# EAGLE design Incubadora-v1 (EAGLE 7.3.0)
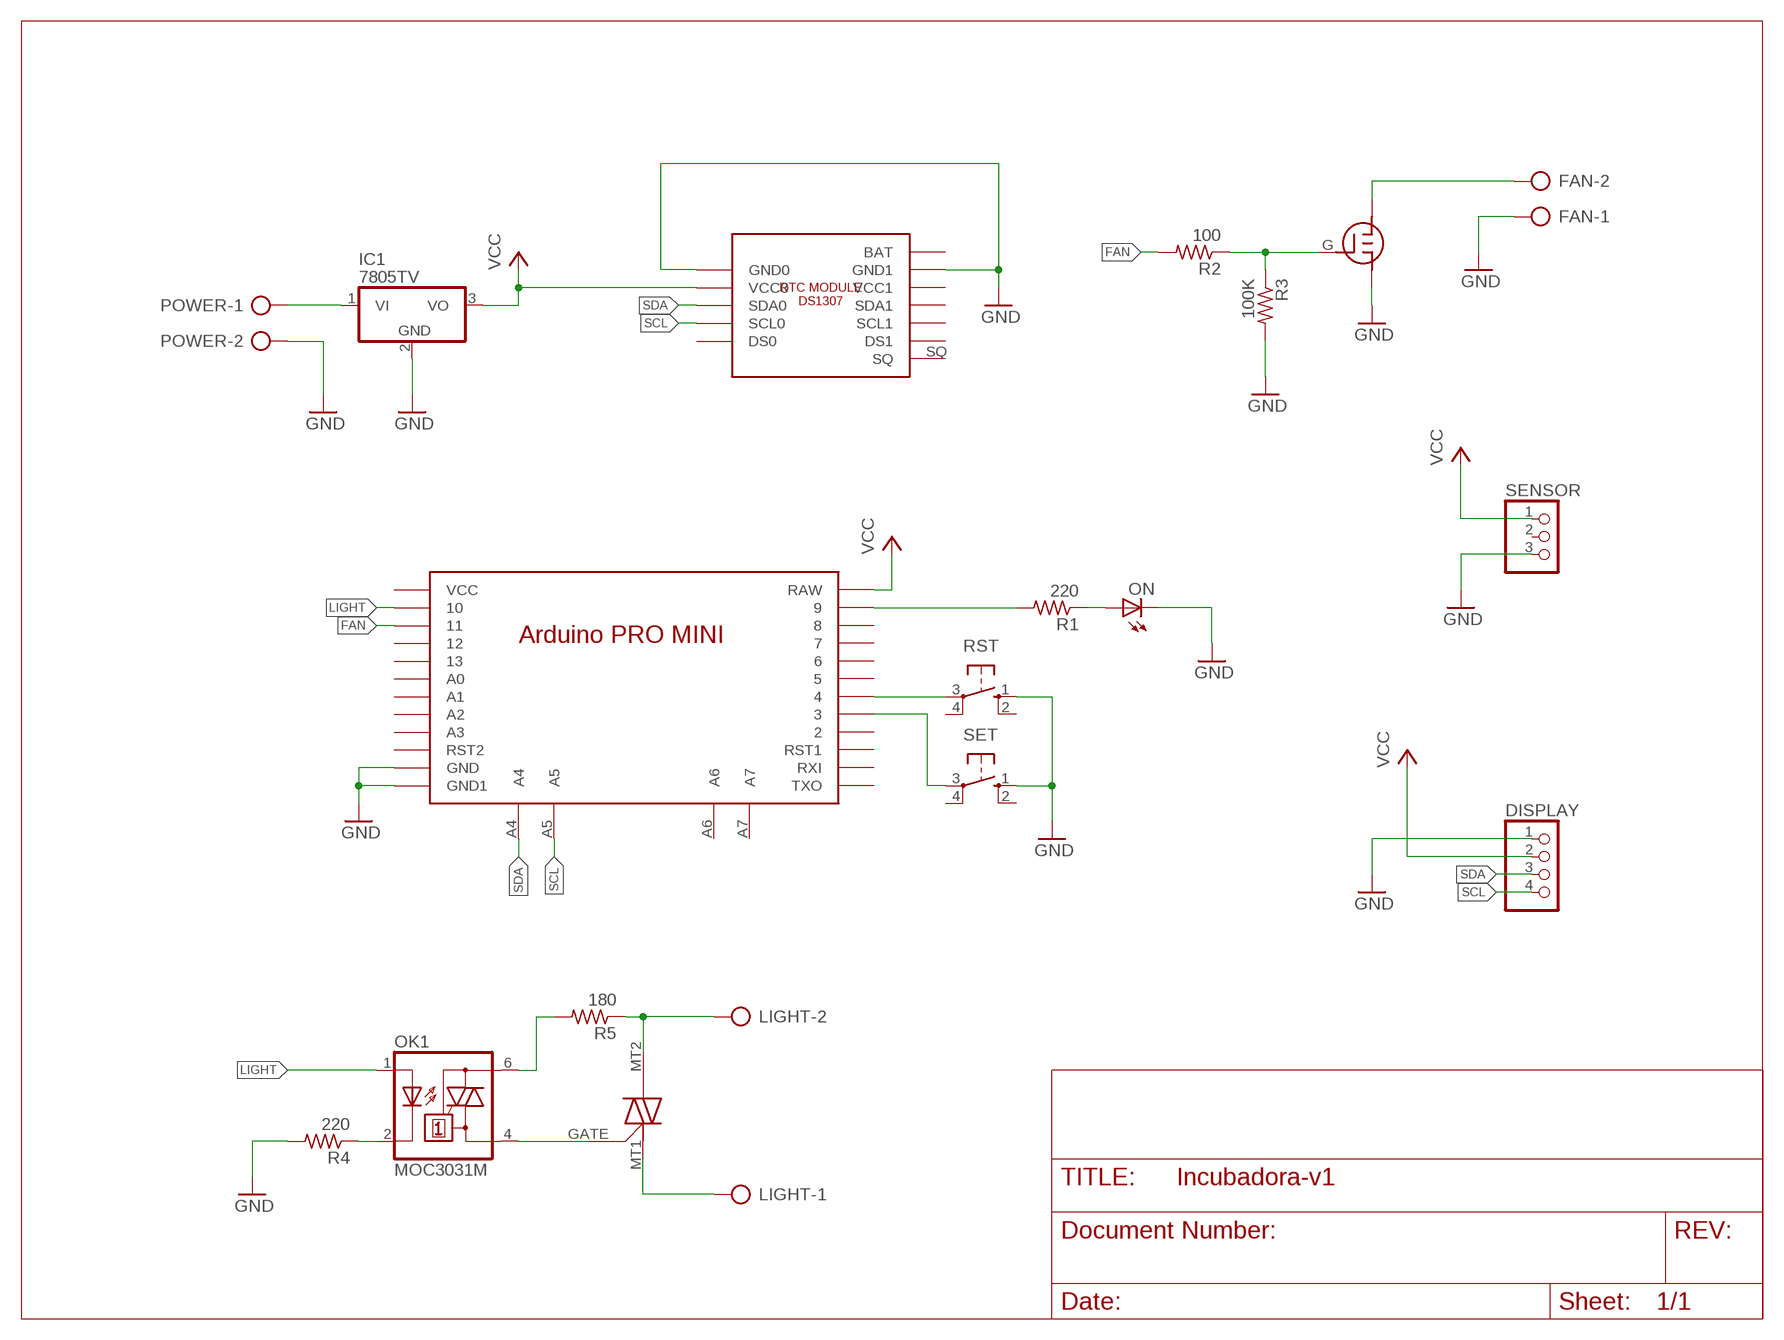
[diagram p0: schematic, sheet 1]

## Parts
DISPLAY  PINHD-1X4  [1X04]
FAN  AK300/2  [AK300/2]
IC1  7805TV  [TO220V]
LIGHT  AK300/2  [AK300/2]
MAC12  MAC12  [MAC12]
OK1  MOC3031M  [DIL06]
ON  LED3MM  [LED3MM]
POWER  AK300/2  [AK300/2]
R1  220  R-US_0204/7  [0204/7]
R2  100  R-US_0204/7  [0204/7]
R3  100K  R-US_0204/7  [0204/7]
R4  220  R-US_0204/7  [0204/7]
R5  180  R-US_0204/7  [0204/7]
RST  10-XX  [B3F-10XX]
SENSOR  PINHD-1X3/90  [1X03/90]
SET  10-XX  [B3F-10XX]
U$1  CLOCK  [CLOCK]
U$2  PROMINI  [PROMINI]
U$3  J111  [J111]

## Nets
FAN: R2.2 U$2.11
GND: DISPLAY.1 FAN.1 IC1.2(GND) ON.K(C) POWER.2 R3.2 R4.2 RST.1(S) SENSOR.3 SET.1(S) U$1.GND0 U$1.GND1 U$2.GND1(GND) U$2.GND2(GND1) U$3.S
LIGHT: OK1.1(A) U$2.10
N$1: ON.A R1.1
N$2: IC1.1(VI) POWER.1
N$3: RST.3(P) U$2.4
N$4: SET.3(P) U$2.3
N$5: R1.2 U$2.9
N$6: FAN.2 U$3.D
N$7: R2.1 R3.1 U$3.G
N$8: LIGHT.2 MAC12.MT2 R5.1
N$9: LIGHT.1 MAC12.MT1
N$10: OK1.2(C) R4.1
N$11: MAC12.GATE OK1.4(A1)
N$12: OK1.6(A2) R5.2
SCL: DISPLAY.4 U$1.SCL0 U$2.A5
SDA: DISPLAY.3 U$1.SDA0 U$2.A4
VCC: DISPLAY.2 IC1.3(VO) SENSOR.1 U$1.VCC0 U$2.RAW
Unconnected: RST.2(S1) RST.4(P1) SENSOR.2 SET.2(S1) SET.4(P1) U$1.BAT U$1.DS0 U$1.DS1 U$1.SCL1 U$1.SDA1 U$1.SQ U$1.VCC1 U$2.2 U$2.5 U$2.6 U$2.7 U$2.8 U$2.12 U$2.13 U$2.A0 U$2.A1 U$2.A2 U$2.A3 U$2.A6 U$2.A7 U$2.RST1 U$2.RST2 U$2.RXI U$2.TXO U$2.VCC

## Library data of the parts
DISPLAY = pinhead:PINHD-1X4: PIN HEADER
FAN LIGHT POWER = con-ptr500:AK300/2: CONNECTOR; OC_FARNELL: unknown; OC_NEWARK: unknown
IC1 = linear:78*: Positive VOLTAGE REGULATOR Source: http://cache.national.com/ds/LM/LM78L05.pdf http://www.fairchildsemi.com/ds/LM/LM7805.pdf
MAC12 = CustomLib:MAC12
OK1 = optocoupler:MOC30*: 6-Pin DIP Zero-Cross Optoisolators Triac Driver Output (250/400 Volt Peak) Source: Data sheet <http://www.fairchildsemi.com/ds/MO/MOC3031M.pdf> The old path of data sheet not more available 2013-05-06.; MF: FAIRCHILD SEMICONDUCTOR; MPN: MOC3031M; OC_FARNELL: 9875964; OC_NEWARK: 78K6089
ON = led:LED: LED OSRAM: - CHIPLED LG R971, LG N971, LY N971, LG Q971, LY Q971, LO R971, LY R971 LH N974, LH R974 LS Q976, LO Q976, LY Q976 LO Q996 - Hyper CHIPLED LW Q18S LB Q993, LB Q99A, LB R99A - SideLED LS A670, LO A670, LY A670, LG A670, LP A670 LB A673, LV A673, LT A673, LW A673 LH A674 LY A675 LS A676, LA A676, LO A676, LY A676, LW A676 LS A679, LY A679, LG A679 - Hyper Micro SIDELED® LS Y876, LA Y876, LO Y876, LY Y876 LT Y87S - SmartLED LW L88C, LW L88S LB L89C, LB L89S, LG L890 LS L89K, LO L89K, LY L89K LS L896, LA L896, LO L896, LY L896 - TOPLED LS T670, LO T670, LY T670, LG T670, LP T670 LSG T670, LSP T670, LSY T670, LOP T670, LYG T670 LG T671, LOG T671, LSG T671 LB T673, LV T673, LT T673, LW T673 LH T674 LS T676, LA T676, LO T676, LY T676, LB T676, LH T676, LSB T676, LW T676 LB T67C, LV T67C, LT T67C, LS T67K, LO T67K, LY T67K, LW E67C LS E67B, LA E67B, LO E67B, LY E67B, LB E67C, LV E67C, LT E67C LW T67C LS T679, LY T679, LG T679 LS T770, LO T770, LY T770, LG T770, LP T770 LB T773, LV T773, LT T773, LW T773 LH T774 LS E675, LA E675, LY E675, LS T675 LS T776, LA T776, LO T776, LY T776, LB T776 LHGB T686 LT T68C, LB T68C - Hyper Mini TOPLED® LB M676 - Mini TOPLED Santana® LG M470 LS M47K, LO M47K, LY M47K Source: http://www.osram.convergy.de LUXEON: - LUMILED® LXK2-PW12-R00, LXK2-PW12-S00, LXK2-PW14-U00, LXK2-PW14-V00 LXK2-PM12-R00, LXK2-PM12-S00, LXK2-PM14-U00 LXK2-PE12-Q00, LXK2-PE12-R00, LXK2-PE12-S00, LXK2-PE14-T00, LXK2-PE14-U00 LXK2-PB12-K00, LXK2-PB12-L00, LXK2-PB12-M00, LXK2-PB14-N00, LXK2-PB14-P00, LXK2-PB14-Q00 LXK2-PR12-L00, LXK2-PR12-M00, LXK2-PR14-Q00, LXK2-PR14-R00 LXK2-PD12-Q00, LXK2-PD12-R00, LXK2-PD12-S00 LXK2-PH12-R00, LXK2-PH12-S00 LXK2-PL12-P00, LXK2-PL12-Q00, LXK2-PL12-R00 Source: www.luxeon.com KINGBRIGHT: KA-3528ASYC Source: www.kingbright.com
R1-R5 = resistor:R-US_: RESISTOR, American symbol
RST SET = switch-omron:10-XX: OMRON SWITCH; MPN: B3F-1000; OC_FARNELL: 176432; OC_NEWARK: 36M3542
SENSOR = pinhead:PINHD-1X3: PIN HEADER
U$1 = CustomLib:CLOCK
U$2 = CustomLib:PROMINI
U$3 = CustomLib:J111: Mosfet J111 This device is designed for low level analog switching, sample and hold circuits and chopper stabilized amplifiers. Sourced from Process 51. Source & Drain are interchangeable

## Board
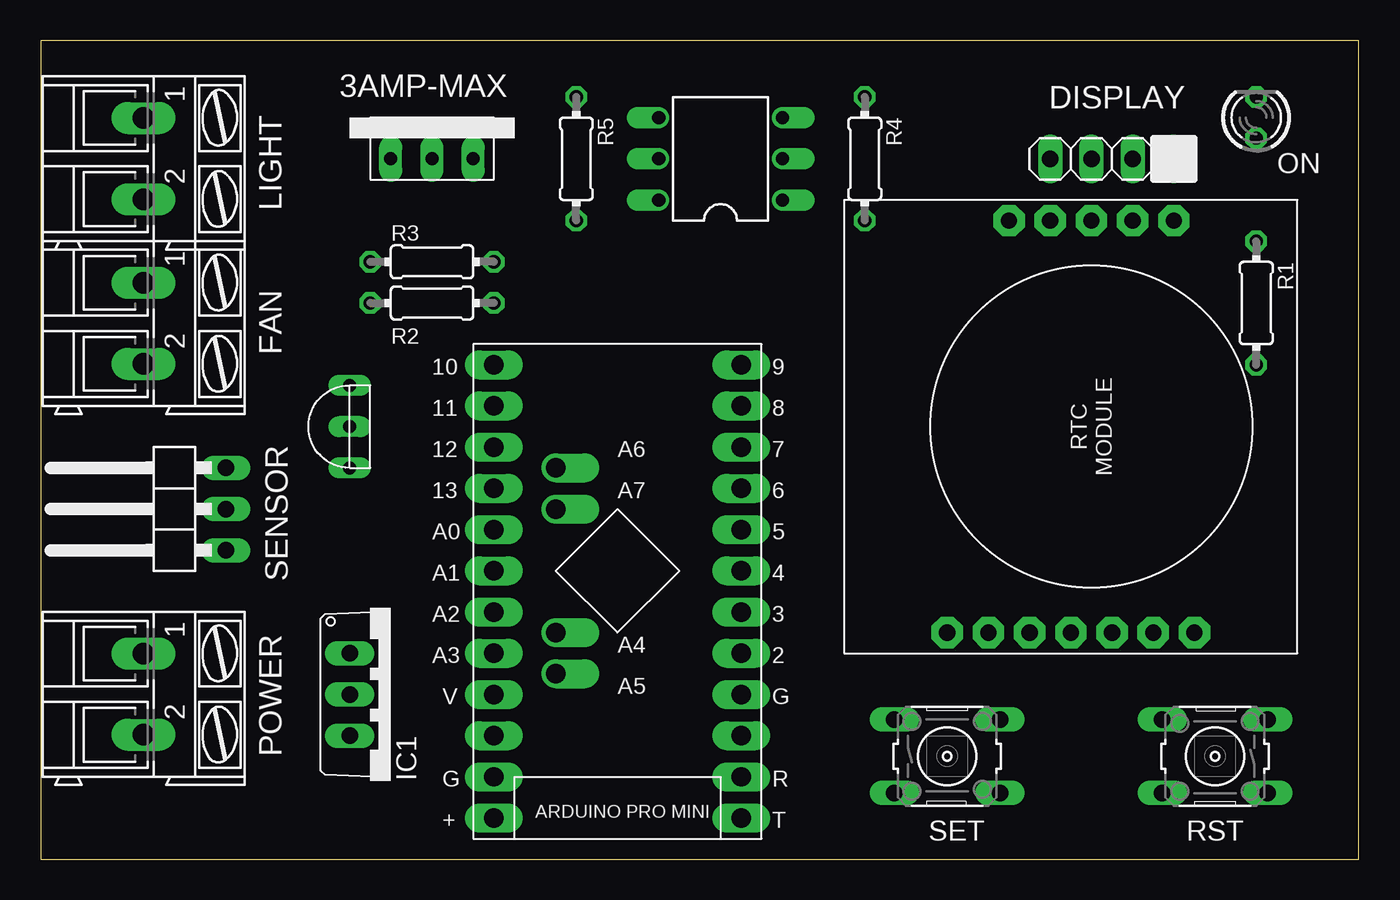
[diagram p1: board, top side]
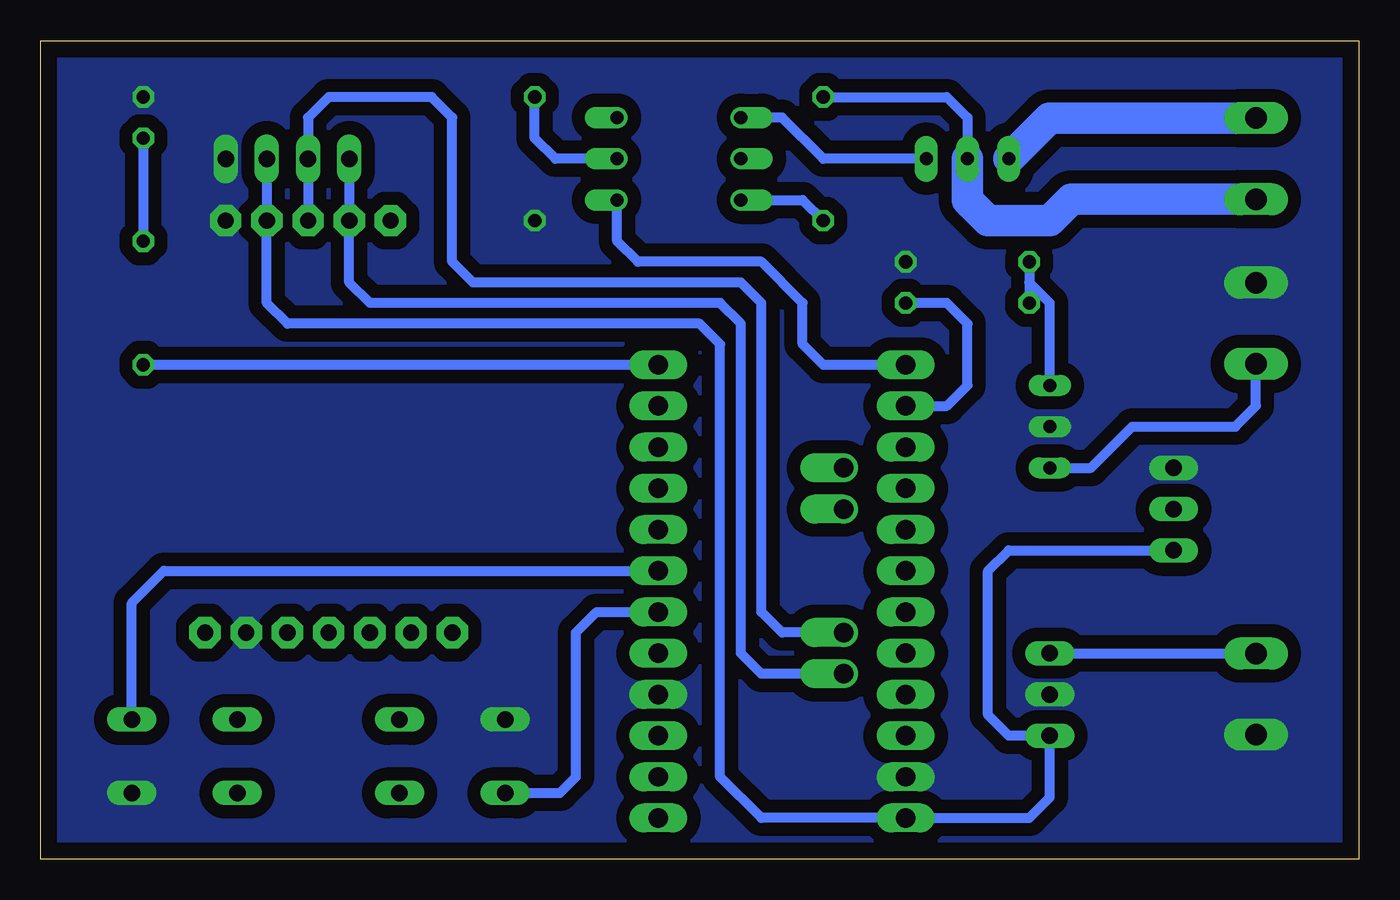
[diagram p2: board, bottom side, seen from below]

Size 81.26 x 50.47 mm. Coordinates in mm from the lower left corner, seen from the top.
Outline: 0,0 81.26,0 81.26,50.47 0,50.47 0,0
Copper layers (1*16): Top 0.035mm / dielectric 1.5mm / Bottom 0.035mm
Design rules "default": minimum track width 10mil, minimum drill 24mil, track to track 8mil, track to pad 8mil, pad to pad 8mil, via to via 8mil, smd to smd 8mil, copper to edge 40mil, drill to drill 8mil, minimum pad ring 10mil, minimum via ring 8mil, stop-mask expansion 4mil, vias tented up to drill 0mil, thermal gap 10mil

### Footprints (pad centres in the part's own frame; a part is rotated, then mirrored left to right if it is on the bottom)
1X04 = drill 1.016 long: 1 -3.81,0; 2 -1.27,0; 3 1.27,0; 4 3.81,0
AK300/2 = drill 1.321 long: 1 -2.515,0; 2 2.489,0
TO220V = drill 1.016 long: 1 -2.54,-2.54; 2 0,-2.54; 3 2.54,-2.54
MAC12 = drill 0.8 pad 1.422 long: GATE 2.54,0; MT1 -2.54,0; MT2 0,0
DIL06 = drill 0.813 offset: 1 -2.54,-3.81; 2 0,-3.81; 3 2.54,-3.81; 4 2.54,3.81; 5 0,3.81; 6 -2.54,3.81
LED3MM = drill 0.813 octagon: A -1.27,0; K 1.27,0
0204/7 = drill 0.813 octagon: 1 -3.81,0; 2 3.81,0
B3F-10XX = drill 1.016 long: 1 -3.251,2.261; 2 3.251,2.261; 3 -3.251,-2.261; 4 3.251,-2.261
1X03/90 = drill 1.016 long: 1 -2.54,-3.81; 2 0,-3.81; 3 2.54,-3.81
CLOCK = drill 1 pad 1.93 octagon: BAT 12.7,7.62; DS0 -12.7,-3.81; DS1 12.7,-5.08; GND0 -12.7,6.35; GND1 12.7,5.08; SCL0 -12.7,-1.27; SCL1 12.7,-2.54; SDA0 -12.7,1.27; SDA1 12.7,0; SQ 12.7,-7.62; VCC0 -12.7,3.81; VCC1 12.7,2.54
PROMINI = drill 1.2 long: 2 7.62,-5.08; 3 7.62,-2.54; 4 7.62,0; 5 7.62,2.54; 6 7.62,5.08; 7 7.62,7.62; 8 7.62,10.16; 9 7.62,12.7; 10 -7.62,12.7; 11 -7.62,10.16; 12 -7.62,7.62; 13 -7.62,5.08; A0 -7.62,2.54; A1 -7.62,0; A2 -7.62,-2.54; A3 -7.62,-5.08; GND1 -7.62,-12.7; GND2 7.62,-7.62; RAW -7.62,-15.24; RST1 -7.62,-10.16; RST2 7.62,-10.16; RXI 7.62,-12.7; TXO 7.62,-15.24; VCC -7.62,-7.62 | drill 1.2 offset: A4 -3.81,-3.81; A5 -3.81,-6.35; A6 -3.81,6.35; A7 -3.81,3.81
J111 = drill 0.8 long: D -2.54,0; G 2.54,0; S 0,0

### Placement (x,y rotation side)
DISPLAY  66.04,43.18 180 top
FAN  6.35,33.02 270 top
IC1  21.59,10.16 270 top
LIGHT  6.35,43.18 270 top
MAC12  24.13,43.18 0 top
OK1  41.91,43.18 90 top
ON  74.93,45.72 90 top
POWER  6.35,10.16 270 top
R1  74.93,34.29 270 top
R2  24.13,34.29 0 top
R3  24.13,36.83 0 top
R4  50.8,43.18 270 top
R5  33.02,43.18 270 top
RST  72.39,6.35 180 top
SENSOR  7.62,21.59 90 top
SET  55.88,6.35 0 top
U$1  63.5,26.67 270 top
U$2  35.56,17.78 0 top
U$3  19.05,26.67 90 top

### Tracks (layer width: path | path; a pad name or v marks a point on that pad's centre or on a via)
FAN
  Bottom 0.61: U$2.11 25.4,27.94 24.13,29.21 24.13,33.02 25.4,34.29 R2.2
GND
  pour Bottom (isolate 0.813, no thermals): 0,50.8 81.28,50.8 81.28,0 0,0
LIGHT
  Bottom 0.61: U$2.10 33.02,30.48 34.29,31.75 34.29,34.29 36.83,36.83 44.45,36.83 45.72,38.1 OK1.1
N$1
  Bottom 0.61: ON.A R1.1
N$2
  Bottom 0.61: IC1.1 6.38,12.7 POWER.1
N$3
  Bottom 0.61: RST.3 75.64,15.8 73.66,17.78 U$2.4
N$4
  Bottom 0.61: SET.3 49.25,4.09 48.26,5.08 48.26,13.97 46.99,15.24 U$2.3
N$5
  Bottom 0.61: U$2.9 R1.2
N$6
  Bottom 0.61: FAN.2 6.35,27.94 7.62,26.67 13.97,26.67 16.51,24.13 U$3.D
N$7
  Bottom 0.61: R3.1 20.32,35.56 | 20.32,35.56 R2.1 | U$3.G 19.05,34.29 20.32,35.56
N$8
  Bottom 0.61: R5.1 25.4,46.99 24.13,45.72 MAC12.MT2
  Bottom 1.93: LIGHT.2 17.73,40.69 19.05,39.37 22.86,39.37 24.13,40.64 MAC12.MT2
N$9
  Bottom 1.93: LIGHT.1 19.07,45.7 MAC12.MT1
N$10
  Bottom 0.61: OK1.2 49.53,43.18 50.8,44.45 R4.1
N$11
  Bottom 0.61: MAC12.GATE 33.02,43.18 35.56,45.72 OK1.4
N$12
  Bottom 0.61: OK1.6 34.29,40.64 R5.2
SCL
  Bottom 0.61: U$2.A5 36.83,11.43 38.1,12.7 38.1,33.02 39.37,34.29 60.96,34.29 62.23,35.56 U$1.SCL0 DISPLAY.4
SDA
  Bottom 0.61: U$2.A4 35.56,13.97 36.83,15.24 36.83,34.29 38.1,35.56 54.61,35.56 55.88,36.83 55.88,45.72 57.15,46.99 63.5,46.99 64.77,45.72 DISPLAY.3 U$1.SDA0
VCC
  Bottom 0.61: DISPLAY.2 U$1.VCC0 67.31,34.29 66.04,33.02 40.64,33.02 39.37,31.75 39.37,5.08 36.83,2.54 U$2.RAW 20.32,2.54 19.05,3.81 IC1.3 21.59,7.62 22.86,8.89 22.86,17.78 21.59,19.05 SENSOR.1

### Text on the board
tNames: 3AMP-MAX